# Altium schematic sheet Sheet3.SchDoc
size A4
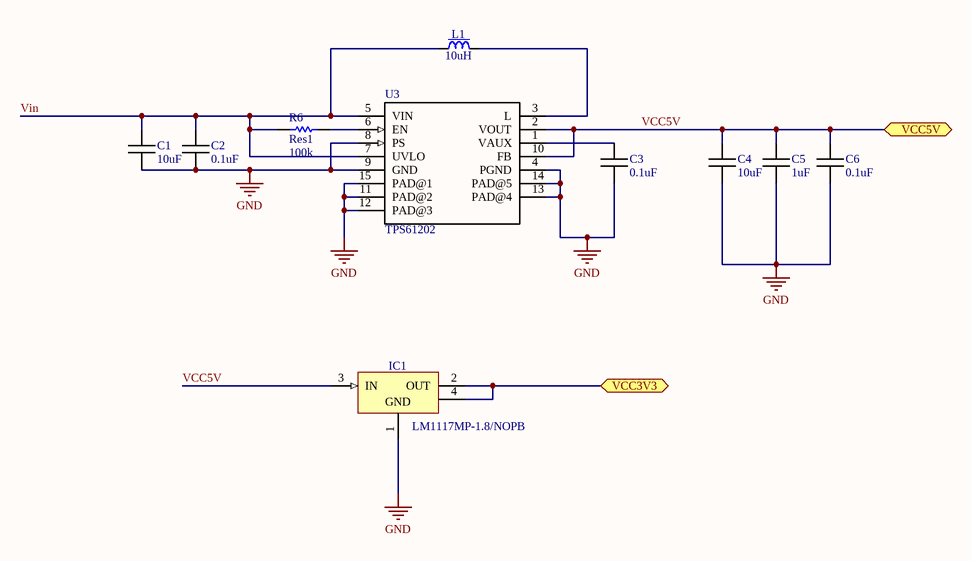
[diagram p0: Sheet3.SchDoc]

## Parts
C1  10uF  [C 0603 / 1608]
C2  0.1uF  [C 0603 / 1608]
C3  0.1uF  [C 0603 / 1608]
C4  10uF  [C 0603 / 1608]
C5  1uF  [C 0603 / 1608]
C6  0.1uF  [C 0603 / 1608]
IC1  LM1117MP-1.8/NOPB  [SOT230P700X180-4N]
L1  10uH  [IND_COILCRAFT_SD43]
R6  Res1  value 100k  [C 0603 / 1608]
U3  TPS61202  [QFN-10_PAD]

## Ports
VCC3V3 (bidir), VCC5V (bidir)

## Nets
GND: C1.1 C2.1 C3.1 C4.1 C5.1 C6.1 IC1.1(GND) U3.4(PGND) U3.8(PS) U3.9(GND) U3.11(PAD@2) U3.12(PAD@3) U3.13(PAD@4) U3.14(PAD@5) U3.15(PAD@1)
VCC3V3: IC1.2(OUT) IC1.4(OUT) ; port VCC3V3
VCC5V: C4.2 C5.2 C6.2 IC1.3(IN) U3.2(VOUT) U3.10(FB) ; port VCC5V
Vin: C1.2 C2.2 L1.1 R6.1 U3.5(VIN) U3.7(UVLO)
NetC3_2: C3.2 U3.1(VAUX)
NetL1_2: L1.2 U3.3(L)
NetR6_2: R6.2 U3.6(EN)

## Library data of the parts
C1-C6 = Capacitor
IC1 = LM1117MP-1.8/NOPB: 3-Terminal Regulator 1=GND 2=OUT 3=IN 4=OUT; Part Description: 1.8V 800mA Low-Dropout Linear Regulator; Manufacturer: TEXAS INSTRUMENTS; PressFit: No; Bonding: No; Part Number: LM1117MP-1.8/NOPB; Component Kind: Standard; Component Type: Standard; Device: LM1117MP-1.8/NOPB; PackageDescription: SOT223, 2.30mm pitch; 3 pin, 3.70mm W X 6.70mm L, IPC Medium Density; Manufacturer Part Number: LM1117MP-1.8/NOPB; Pin Count: 4; Case: SOT223; Mounted: Yes; Socket: No; SMD: Yes; Sense: No; ComponentHeight: 1.8mm; HelpURL: \\cern.ch\dfs\Applications\Altium\Datasheets\LM1117MP-1.8-NOPB.pdf; Author: CERN DEM JLC; CreateDate: 18/01/2011; LatestRevisionDate: 16/09/2014
L1 = IND_10UH_20%_COILCRAFT_SD43-103MLB: Inductor With Core; Part Description: SMT Power Inductor (SD43 Series); Power: 1.3A; Resistance: 0.182R; Tolerance: ±20%; Part Number: IND_10UH_20%_COILCRAFT_SD43-103MLB; Component Kind: Standard; Component Type: Standard; Pin Count: 2; Value: 10uH; Status: None; Manufacturer: COILCRAFT; Manufacturer Part Number: SD43-103MLB; Mounted: Yes; Socket: No; SMD: Yes; Sense: No; ComponentHeight: 3.45mm; HelpURL: \\cern.ch\dfs\Applications\Altium\Datasheets\IND_COILCRAFT_SD43.pdf; Author: CERN DEM JLC; CreateDate: 05/12/2016; LatestRevisionDate: 05/12/2016
R6 = Res1: Resistor; Published: 8-Jun-2000; LatestRevisionDate: 17-Jul-2002; LatestRevisionNote: Re-released for DXP Platform.; PackageReference: AXIAL-0.3; Publisher: Altium Limited; PackageDescription: Axial Device, Thru-Hole; 2 Leads; 0.3 in Pin Spacing
U3 = TPS61200: 0.3V Input Voltage Boost Converter with 1.3A Switches and Down Mode in 3x3 QFN; MF: Texas Instruments; Package: QFN-10 Texas Instruments; Price: None; Availability: Unavailable; MP: TPS61200; SnapEDA_Link: https://www.snapeda.com/parts/TPS61200/Texas%2520Instruments/view-part/?ref=snap; Value: *